# EAGLE board Main DIY board - no 3V3 (EAGLE 9.0.0)
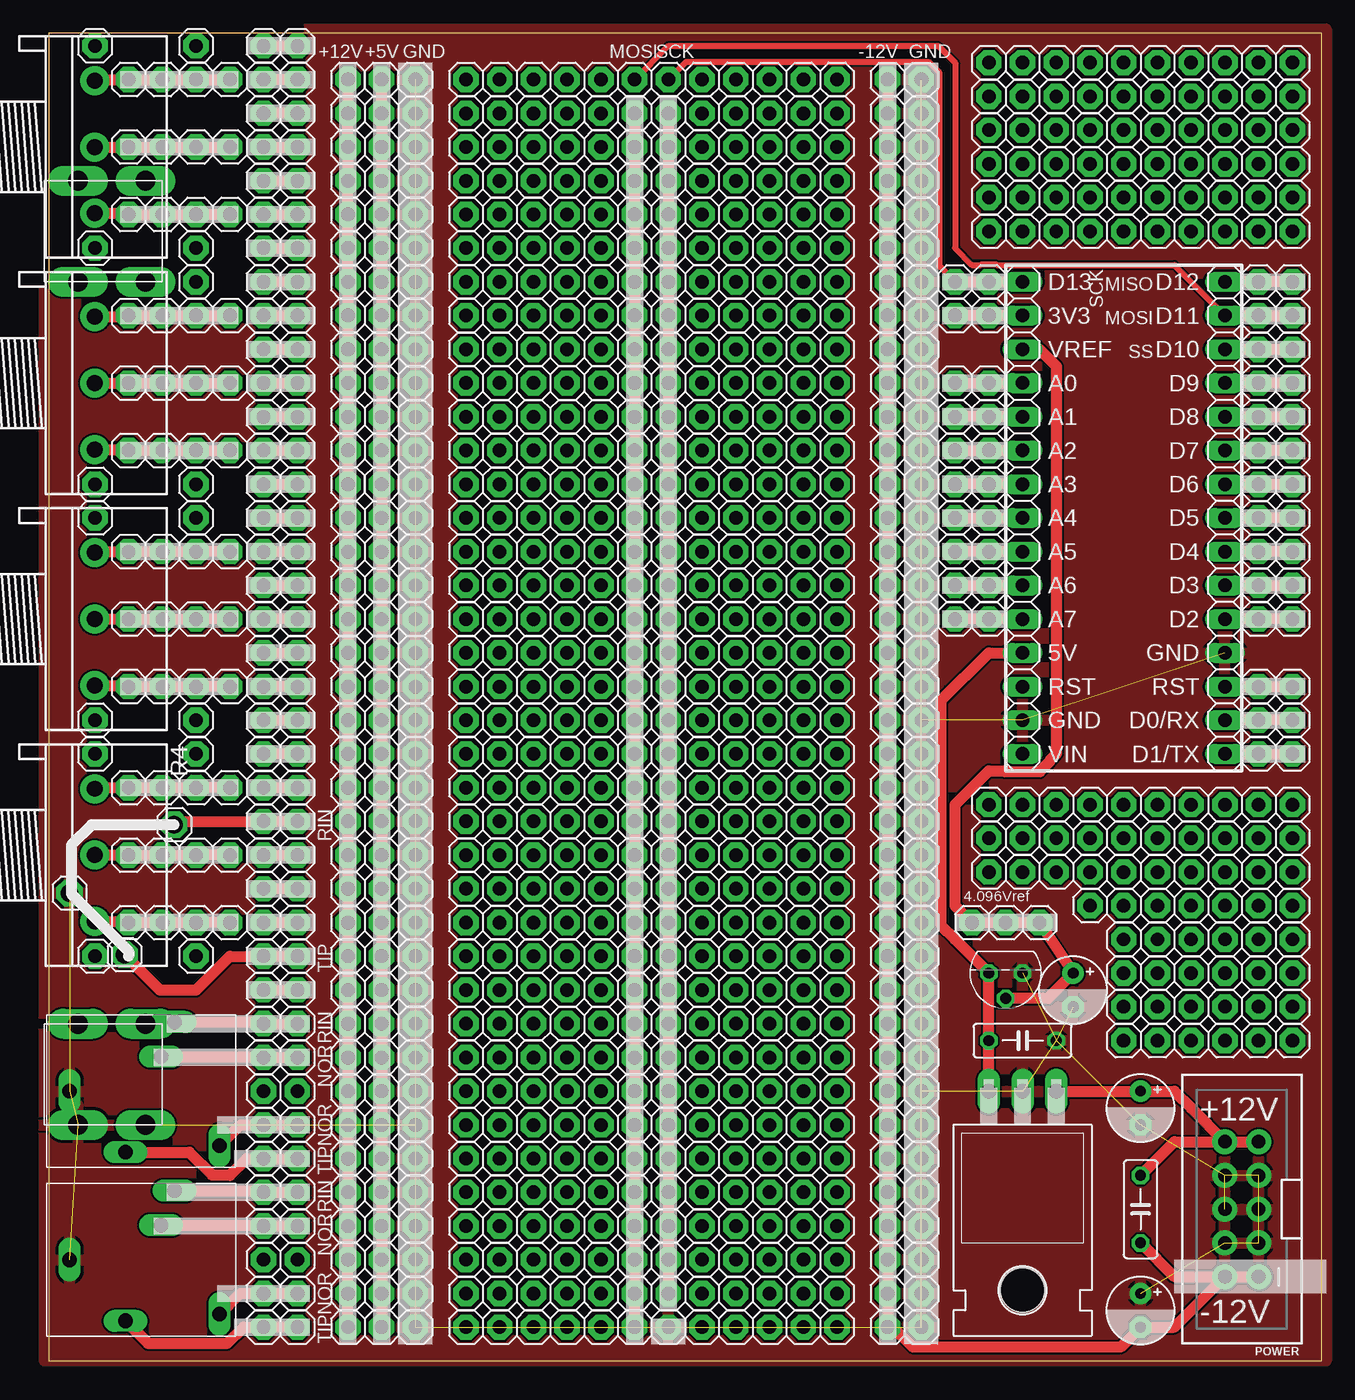
[diagram p2: board, top side]
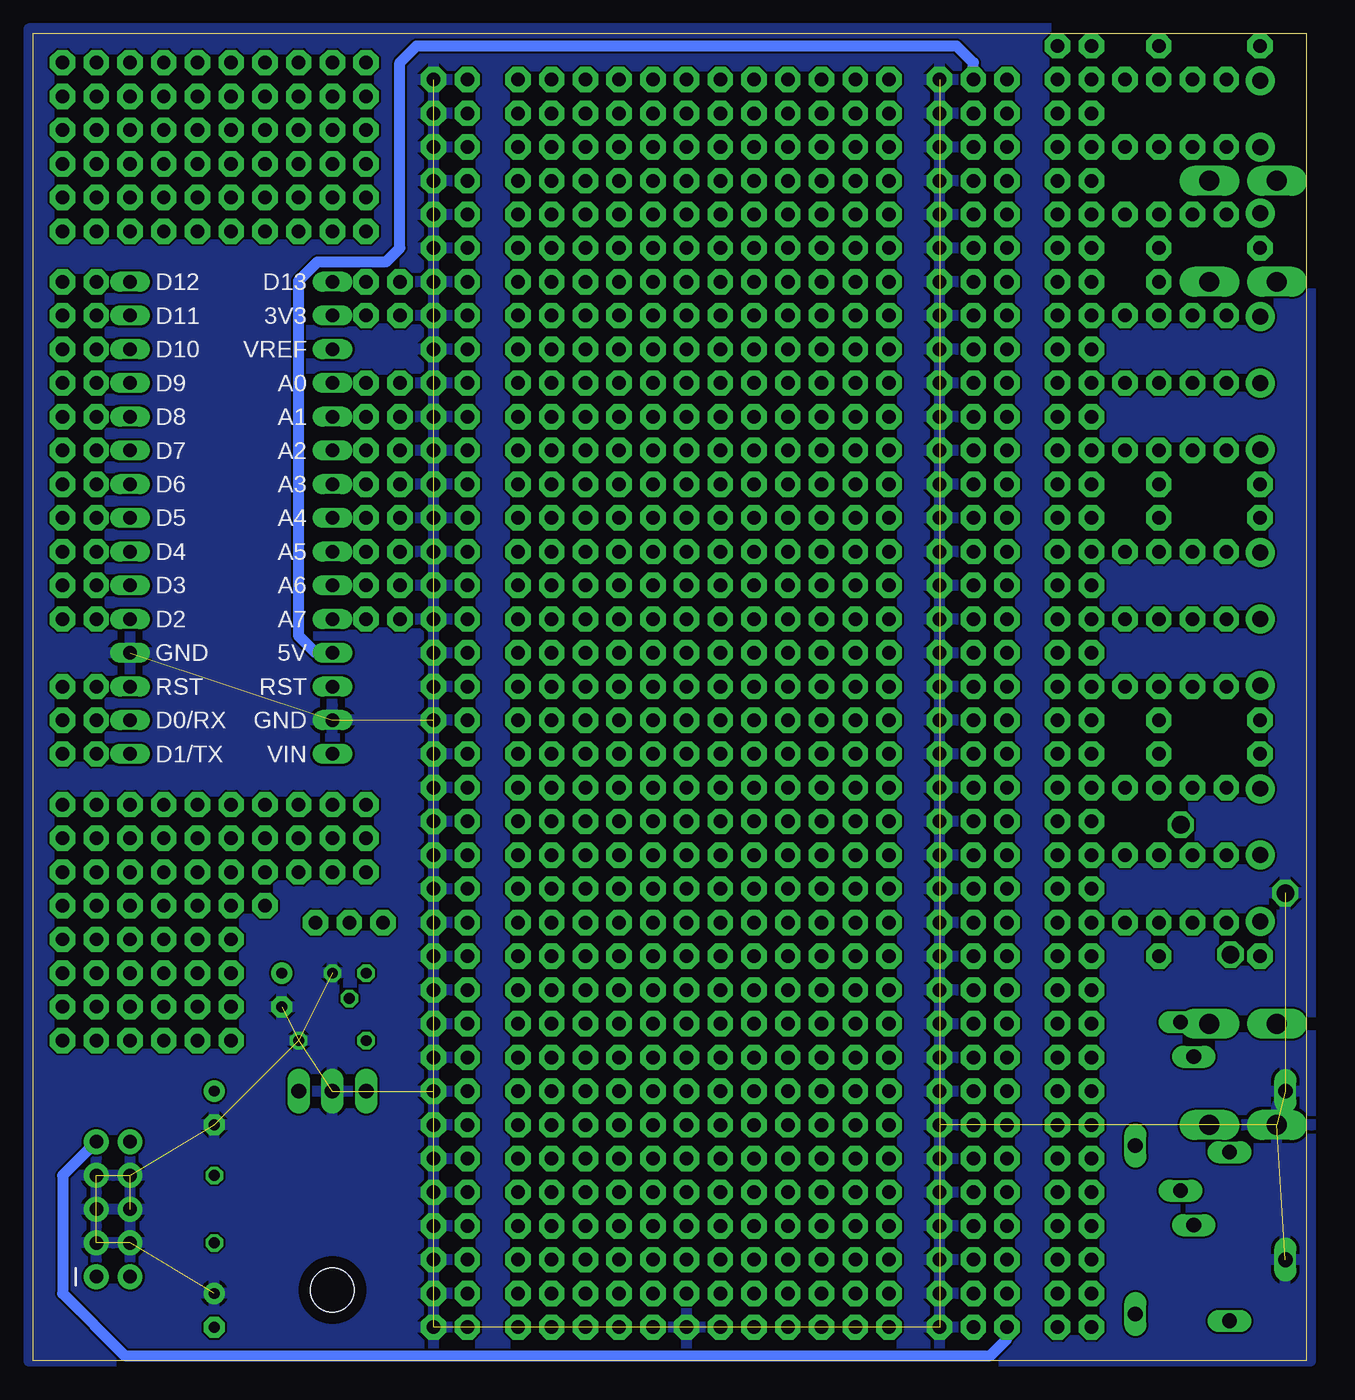
[diagram p3: board, bottom side, seen from below]

Size 95.87 x 100 mm. Coordinates in mm from the lower left corner, seen from the top.
Outline: 0,0 95.87,0 95.87,100 0,100 0,0
Copper layers (1*16): Top 0.035mm / dielectric 1.5mm / Bottom 0.035mm
Design rules "default *": minimum track width 6mil, minimum drill 0.35mm, track to track 6mil, track to pad 6mil, pad to pad 6mil, via to via 6mil, smd to smd 6mil, copper to edge 0mil, drill to drill 6mil, minimum pad ring 10mil, minimum via ring 8mil, stop-mask expansion 4mil, vias tented up to drill 0mil, thermal gap 10mil
Net classes: 0 default: width 0.457 mm, clearance 0.152 mm; 1 power: width 0.813 mm, clearance 0.152 mm

## Footprints (pad centres in the part's own frame; a part is rotated, then mirrored left to right if it is on the bottom)
1X15 = drill 1.016 long: 1 -17.78,0; 2 -15.24,0; 3 -12.7,0; 4 -10.16,0; 5 -7.62,0; 6 -5.08,0; 7 -2.54,0; 8 0,0; 9 2.54,0; 10 5.08,0; 11 7.62,0; 12 10.16,0; 13 12.7,0; 14 15.24,0; 15 17.78,0
C050-025X075 = drill 0.813 octagon: 1 -2.54,0; 2 2.54,0
E2,5-5 = drill 0.813 pad 1.6: + -1.27,0 | drill 0.813 pad 1.6 octagon: - 1.27,0
PJ-324MH = drill 1.1 long: 1 -5.4,0; 2 2.5,5.2; 3 1.5,2.6; 4 5.9,-4.1; 5 -1.2,-4.6
TO92 = drill 0.813 octagon: 1 -1.27,0; 2 0,1.905; 3 1.27,0
TO220H = drill 1.118 long: 1 -2.54,-10.16; 2 0,-10.16; 3 2.54,-10.16 | hole 3.302: 0,4.826
1X01 = drill 1.016 pad 1.905 octagon: 1 0,0
1X01-WIDE = drill 1.321 pad 1.778 octagon: 1 0,0
2X5-SHROUDED = drill 1.016 pad 1.88: 1 -1.27,5.08; 2 1.27,5.08; 3 -1.27,2.54; 4 1.27,2.54; 5 -1.27,0; 6 1.27,0; 7 -1.27,-2.54; 8 1.27,-2.54; 9 -1.27,-5.08; 10 1.27,-5.08
3RP/1610N = drill 1.2 pad 2.184: 1 -5,0; 2 0,0; 3 5,0
RIGHTANGLE = drill 1.5 long: P$1 -2.54,3.81; P$2 2.54,3.81; P$3 -2.54,-3.81; P$4 2.54,-3.81

## Placement (x,y rotation side)
ARD1  [1X15]  88.58,63.5 270 top
ARD2  [1X15]  73.34,63.5 270 top
C6  100n  [C050-025X075]  73.34,24.13 0 top
C7  100n  [C050-025X075]  82.23,11.43 270 top
C8  10u  [E2,5-5]  82.23,19.05 270 top
C9  10u  [E2,5-5]  82.23,3.81 270 top
C13  10u  [E2,5-5]  77.15,27.94 270 top
GATE1  [PJ-324MH]  6.98,20.32 0 top
GATE2  [PJ-324MH]  6.98,7.62 0 top
IC1  MC1541TO  [TO92]  72.07,29.21 180 top
IC3  7805  [TO220H]  73.34,10.16 180 top
JP1  1X01  [1X01]  3.49,83.82 0 top
JP2  1X01  [1X01]  6.03,86.36 0 top
JP3  1X01  [1X01]  8.57,86.36 0 top
JP4  1X01  [1X01]  3.49,99.06 0 top
JP5  1X01  [1X01]  11.11,86.36 0 top
JP6  1X01  [1X01]  6.03,91.44 0 top
JP7  1X01  [1X01]  8.57,91.44 0 top
JP8  1X01  [1X01]  11.11,91.44 0 top
JP9  1X01  [1X01]  6.03,96.52 0 top
JP10  1X01  [1X01]  8.57,96.52 0 top
JP11  1X01  [1X01]  11.11,96.52 0 top
JP12  1X01  [1X01]  11.11,99.06 0 top
JP13  1X01  [1X01]  11.11,83.82 0 top
JP14  1X01  [1X01]  6.03,68.58 0 top
JP15  1X01  [1X01]  11.11,68.58 0 top
JP16  1X01  [1X01]  8.57,68.58 0 top
JP17  1X01  [1X01]  6.03,73.66 0 top
JP18  1X01  [1X01]  11.11,73.66 0 top
JP19  1X01  [1X01]  8.57,73.66 0 top
JP20  1X01  [1X01]  6.03,78.74 0 top
JP21  1X01  [1X01]  11.11,78.74 0 top
JP22  1X01  [1X01]  8.57,78.74 0 top
JP23  1X01  [1X01]  6.03,50.8 0 top
JP24  1X01  [1X01]  11.11,50.8 0 top
JP25  1X01  [1X01]  8.57,50.8 0 top
JP26  1X01  [1X01]  6.03,55.88 0 top
JP27  1X01  [1X01]  11.11,55.88 0 top
JP28  1X01  [1X01]  8.57,55.88 0 top
JP29  1X01  [1X01]  6.03,60.96 0 top
JP30  1X01  [1X01]  11.11,60.96 0 top
JP31  1X01  [1X01]  8.57,60.96 0 top
JP32  1X01  [1X01]  3.49,45.72 0 top
JP33  1X01  [1X01]  11.11,45.72 0 top
JP34  1X01  [1X01]  8.57,33.02 0 top
JP35  1X01  [1X01]  6.03,33.02 0 top
JP36  1X01  [1X01]  11.11,33.02 0 top
JP37  1X01  [1X01]  6.03,38.1 0 top
JP38  1X01  [1X01]  8.57,38.1 0 top
JP39  1X01  [1X01]  11.11,38.1 0 top
JP40  1X01  [1X01]  6.03,43.18 0 top
JP41  1X01  [1X01]  8.57,43.18 0 top
JP42  1X01  [1X01]  11.11,43.18 0 top
JP43  1X01  [1X01]  3.49,30.48 0 top
JP44  1X01  [1X01]  11.11,30.48 0 top
JP45  1X01  [1X01]  13.65,86.36 0 top
JP46  1X01  [1X01]  16.19,99.06 0 top
JP47  1X01  [1X01]  13.65,91.44 0 top
JP48  1X01  [1X01]  18.73,99.06 0 top
JP49  1X01  [1X01]  13.65,96.52 0 top
JP50  1X01  [1X01]  16.19,71.12 0 top
JP51  1X01  [1X01]  13.65,68.58 0 top
JP52  1X01  [1X01]  18.73,71.12 0 top
JP53  1X01  [1X01]  13.65,73.66 0 top
JP54  1X01  [1X01]  16.19,60.96 0 top
JP55  1X01  [1X01]  13.65,78.74 0 top
JP56  1X01  [1X01]  18.73,60.96 0 top
JP57  1X01  [1X01]  13.65,50.8 0 top
JP58  1X01  [1X01]  16.19,96.52 0 top
JP59  1X01  [1X01]  13.65,55.88 0 top
JP60  1X01  [1X01]  18.73,96.52 0 top
JP61  1X01  [1X01]  13.65,60.96 0 top
JP62  1X01  [1X01]  16.19,91.44 0 top
JP63  1X01  [1X01]  13.65,33.02 0 top
JP64  1X01  [1X01]  18.73,91.44 0 top
JP65  1X01  [1X01]  13.65,38.1 0 top
JP66  1X01  [1X01]  16.19,73.66 0 top
JP67  1X01  [1X01]  13.65,43.18 0 top
JP68  1X01  [1X01]  18.73,73.66 0 top
JP69  1X01  [1X01]  16.19,68.58 0 top
JP70  1X01  [1X01]  18.73,68.58 0 top
JP71  1X01  [1X01]  16.19,93.98 0 top
JP72  1X01  [1X01]  18.73,93.98 0 top
JP73  1X01  [1X01]  16.19,88.9 0 top
JP74  1X01  [1X01]  18.73,88.9 0 top
JP75  1X01  [1X01]  16.19,76.2 0 top
JP76  1X01  [1X01]  18.73,76.2 0 top
JP77  1X01  [1X01]  18.73,66.04 0 top
JP78  1X01  [1X01]  16.19,66.04 0 top
JP79  1X01  [1X01]  16.19,86.36 0 top
JP80  1X01  [1X01]  18.73,86.36 0 top
JP81  1X01  [1X01]  18.73,83.82 0 top
JP82  1X01  [1X01]  16.19,83.82 0 top
JP83  1X01  [1X01]  16.19,78.74 0 top
JP84  1X01  [1X01]  18.73,78.74 0 top
JP85  1X01  [1X01]  18.73,63.5 0 top
JP86  1X01  [1X01]  16.19,63.5 0 top
JP87  1X01  [1X01]  16.19,30.48 0 top
JP88  1X01  [1X01]  16.19,55.88 0 top
JP89  1X01  [1X01]  18.73,55.88 0 top
JP90  1X01  [1X01]  16.19,53.34 0 top
JP91  1X01  [1X01]  16.19,81.28 0 top
JP92  1X01  [1X01]  18.73,81.28 0 top
JP93  1X01  [1X01]  18.73,53.34 0 top
JP94  1X01  [1X01]  18.73,58.42 0 top
JP95  1X01  [1X01]  16.19,58.42 0 top
JP96  1X01  [1X01]  16.19,48.26 0 top
JP97  1X01  [1X01]  18.73,48.26 0 top
JP98  1X01  [1X01]  16.19,50.8 0 top
JP99  1X01  [1X01]  18.73,50.8 0 top
JP100  1X01  [1X01]  18.73,43.18 0 top
JP101  1X01  [1X01]  16.19,43.18 0 top
JP102  1X01  [1X01]  18.73,40.64 0 top
JP103  1X01  [1X01]  16.19,40.64 0 top
JP104  1X01  [1X01]  16.19,45.72 0 top
JP105  1X01  [1X01]  18.73,45.72 0 top
JP106  1X01  [1X01]  18.73,38.1 0 top
JP107  1X01  [1X01]  16.19,38.1 0 top
JP108  1X01  [1X01]  18.73,35.56 0 top
JP109  1X01  [1X01]  16.19,35.56 0 top
JP110  1X01  [1X01]  16.19,27.94 0 top
JP111  1X01  [1X01]  18.73,27.94 0 top
JP112  1X01  [1X01]  18.73,33.02 0 top
JP113  1X01  [1X01]  16.19,33.02 0 top
JP114  1X01  [1X01]  22.54,96.52 0 top
JP115  1X01  [1X01]  22.54,93.98 0 top
JP116  1X01  [1X01]  18.73,30.48 0 top
JP117  1X01  [1X01]  22.54,91.44 0 top
JP118  1X01  [1X01]  22.54,88.9 0 top
JP119  1X01  [1X01]  22.54,86.36 0 top
JP120  1X01  [1X01]  22.54,83.82 0 top
JP121  1X01  [1X01]  22.54,81.28 0 top
JP122  1X01  [1X01]  22.54,78.74 0 top
JP123  1X01  [1X01]  22.54,76.2 0 top
JP124  1X01  [1X01]  22.54,73.66 0 top
JP125  1X01  [1X01]  22.54,71.12 0 top
JP126  1X01  [1X01]  22.54,68.58 0 top
JP127  1X01  [1X01]  22.54,66.04 0 top
JP128  1X01  [1X01]  22.54,63.5 0 top
JP129  1X01  [1X01]  22.54,60.96 0 top
JP130  1X01  [1X01]  22.54,58.42 0 top
JP131  1X01  [1X01]  22.54,55.88 0 top
JP132  1X01  [1X01]  22.54,53.34 0 top
JP133  1X01  [1X01]  22.54,50.8 0 top
JP134  1X01  [1X01]  22.54,48.26 0 top
JP135  1X01  [1X01]  22.54,45.72 0 top
JP136  1X01  [1X01]  22.54,43.18 0 top
JP137  1X01  [1X01]  22.54,40.64 0 top
JP138  1X01  [1X01]  22.54,38.1 0 top
JP139  1X01  [1X01]  22.54,35.56 0 top
JP140  1X01  [1X01]  22.54,33.02 0 top
JP141  1X01  [1X01]  22.54,30.48 0 top
JP142  1X01  [1X01]  22.54,27.94 0 top
JP143  1X01  [1X01]  22.54,25.4 0 top
JP144  1X01  [1X01]  22.54,22.86 0 top
JP145  1X01  [1X01]  22.54,20.32 0 top
JP146  1X01  [1X01]  22.54,17.78 0 top
JP147  1X01  [1X01]  22.54,15.24 0 top
JP148  1X01  [1X01]  22.54,12.7 0 top
JP149  1X01  [1X01]  22.54,10.16 0 top
JP150  1X01  [1X01]  22.54,7.62 0 top
JP151  1X01  [1X01]  22.54,5.08 0 top
JP152  1X01  [1X01]  22.54,2.54 0 top
JP153  1X01  [1X01]  3.49,63.5 0 top
JP154  1X01  [1X01]  27.62,93.98 0 top
JP155  1X01  [1X01]  27.62,91.44 0 top
JP156  1X01  [1X01]  27.62,88.9 0 top
JP157  1X01  [1X01]  27.62,86.36 0 top
JP158  1X01  [1X01]  27.62,83.82 0 top
JP159  1X01  [1X01]  27.62,81.28 0 top
JP160  1X01  [1X01]  27.62,78.74 0 top
JP161  1X01  [1X01]  27.62,76.2 0 top
JP162  1X01  [1X01]  27.62,73.66 0 top
JP163  1X01  [1X01]  27.62,71.12 0 top
JP164  1X01  [1X01]  27.62,68.58 0 top
JP165  1X01  [1X01]  27.62,66.04 0 top
JP166  1X01  [1X01]  27.62,60.96 0 top
JP167  1X01  [1X01]  27.62,55.88 0 top
JP168  1X01  [1X01]  27.62,50.8 0 top
JP169  1X01  [1X01]  27.62,45.72 0 top
JP170  1X01  [1X01]  27.62,40.64 0 top
JP171  1X01  [1X01]  27.62,35.56 0 top
JP172  1X01  [1X01]  27.62,30.48 0 top
JP173  1X01  [1X01]  27.62,25.4 0 top
JP174  1X01  [1X01]  27.62,20.32 0 top
JP175  1X01  [1X01]  27.62,15.24 0 top
JP176  1X01  [1X01]  27.62,10.16 0 top
JP177  1X01  [1X01]  27.62,63.5 0 top
JP178  1X01  [1X01]  27.62,58.42 0 top
JP179  1X01  [1X01]  27.62,53.34 0 top
JP180  1X01  [1X01]  27.62,48.26 0 top
JP181  1X01  [1X01]  27.62,43.18 0 top
JP182  1X01  [1X01]  27.62,38.1 0 top
JP183  1X01  [1X01]  27.62,33.02 0 top
JP184  1X01  [1X01]  27.62,27.94 0 top
JP185  1X01  [1X01]  27.62,22.86 0 top
JP186  1X01  [1X01]  27.62,17.78 0 top
JP187  1X01  [1X01]  27.62,12.7 0 top
JP188  1X01  [1X01]  27.62,7.62 0 top
JP189  1X01  [1X01]  27.62,5.08 0 top
JP190  1X01  [1X01]  27.62,2.54 0 top
JP191  1X01  [1X01]  31.43,96.52 0 top
JP192  1X01  [1X01]  11.11,63.5 0 top
JP193  1X01  [1X01]  44.13,93.98 0 top
JP194  1X01  [1X01]  44.13,91.44 0 top
JP195  1X01  [1X01]  44.13,88.9 0 top
JP196  1X01  [1X01]  44.13,86.36 0 top
JP197  1X01  [1X01]  44.13,83.82 0 top
JP198  1X01  [1X01]  44.13,81.28 0 top
JP199  1X01  [1X01]  44.13,78.74 0 top
JP200  1X01  [1X01]  44.13,76.2 0 top
JP201  1X01  [1X01]  44.13,73.66 0 top
JP202  1X01  [1X01]  44.13,71.12 0 top
JP203  1X01  [1X01]  44.13,68.58 0 top
JP204  1X01  [1X01]  44.13,66.04 0 top
JP205  1X01  [1X01]  44.13,63.5 0 top
JP206  1X01  [1X01]  44.13,60.96 0 top
JP207  1X01  [1X01]  44.13,58.42 0 top
JP208  1X01  [1X01]  44.13,55.88 0 top
JP209  1X01  [1X01]  44.13,53.34 0 top
JP210  1X01  [1X01]  44.13,50.8 0 top
JP211  1X01  [1X01]  44.13,45.72 0 top
JP212  1X01  [1X01]  44.13,48.26 0 top
JP213  1X01  [1X01]  44.13,43.18 0 top
JP214  1X01  [1X01]  44.13,40.64 0 top
JP215  1X01  [1X01]  44.13,38.1 0 top
JP216  1X01  [1X01]  44.13,35.56 0 top
JP217  1X01  [1X01]  44.13,33.02 0 top
JP218  1X01  [1X01]  44.13,30.48 0 top
JP219  1X01  [1X01]  44.13,27.94 0 top
JP220  1X01  [1X01]  44.13,20.32 0 top
JP221  1X01  [1X01]  44.13,25.4 0 top
JP222  1X01  [1X01]  44.13,22.86 0 top
JP223  1X01  [1X01]  44.13,17.78 0 top
JP224  1X01  [1X01]  44.13,15.24 0 top
JP225  1X01  [1X01]  44.13,12.7 0 top
JP226  1X01  [1X01]  44.13,7.62 0 top
JP227  1X01  [1X01]  44.13,5.08 0 top
JP228  1X01  [1X01]  44.13,10.16 0 top
JP229  1X01  [1X01]  36.51,96.52 0 top
JP230  1X01  [1X01]  46.67,86.36 0 top
JP231  1X01  [1X01]  3.49,48.26 0 top
JP232  1X01  [1X01]  46.67,93.98 0 top
JP233  1X01  [1X01]  46.67,91.44 0 top
JP234  1X01  [1X01]  46.67,88.9 0 top
JP235  1X01  [1X01]  46.67,73.66 0 top
JP236  1X01  [1X01]  46.67,71.12 0 top
JP237  1X01  [1X01]  46.67,68.58 0 top
JP238  1X01  [1X01]  46.67,66.04 0 top
JP239  1X01  [1X01]  46.67,83.82 0 top
JP240  1X01  [1X01]  46.67,81.28 0 top
JP241  1X01  [1X01]  46.67,78.74 0 top
JP242  1X01  [1X01]  46.67,76.2 0 top
JP243  1X01  [1X01]  46.67,53.34 0 top
JP244  1X01  [1X01]  46.67,50.8 0 top
JP245  1X01  [1X01]  46.67,48.26 0 top
JP246  1X01  [1X01]  46.67,45.72 0 top
JP247  1X01  [1X01]  46.67,63.5 0 top
JP248  1X01  [1X01]  46.67,60.96 0 top
JP249  1X01  [1X01]  46.67,58.42 0 top
JP250  1X01  [1X01]  46.67,55.88 0 top
JP251  1X01  [1X01]  46.67,33.02 0 top
JP252  1X01  [1X01]  46.67,30.48 0 top
JP253  1X01  [1X01]  46.67,27.94 0 top
JP254  1X01  [1X01]  46.67,25.4 0 top
JP255  1X01  [1X01]  46.67,43.18 0 top
JP256  1X01  [1X01]  46.67,40.64 0 top
JP257  1X01  [1X01]  46.67,38.1 0 top
JP258  1X01  [1X01]  46.67,35.56 0 top
JP259  1X01  [1X01]  46.67,15.24 0 top
JP260  1X01  [1X01]  46.67,12.7 0 top
JP261  1X01  [1X01]  46.67,10.16 0 top
JP262  1X01  [1X01]  46.67,7.62 0 top
JP263  1X01  [1X01]  46.67,22.86 0 top
JP264  1X01  [1X01]  46.67,20.32 0 top
JP265  1X01  [1X01]  46.67,17.78 0 top
JP266  1X01  [1X01]  31.43,91.44 0 top
JP267  1X01  [1X01]  63.18,96.52 0 top
JP268  1X01  [1X01]  63.18,93.98 0 top
JP269  1X01  [1X01]  63.18,91.44 0 top
JP270  1X01  [1X01]  63.18,86.36 0 top
JP271  1X01  [1X01]  63.18,83.82 0 top
JP272  1X01  [1X01]  63.18,81.28 0 top
JP273  1X01  [1X01]  63.18,78.74 0 top
JP274  1X01  [1X01]  63.18,76.2 0 top
JP275  1X01  [1X01]  63.18,73.66 0 top
JP276  1X01  [1X01]  63.18,71.12 0 top
JP277  1X01  [1X01]  63.18,88.9 0 top
JP278  1X01  [1X01]  63.18,68.58 0 top
JP279  1X01  [1X01]  63.18,66.04 0 top
JP280  1X01  [1X01]  63.18,63.5 0 top
JP281  1X01  [1X01]  63.18,60.96 0 top
JP282  1X01  [1X01]  63.18,58.42 0 top
JP283  1X01  [1X01]  63.18,55.88 0 top
JP284  1X01  [1X01]  63.18,53.34 0 top
JP285  1X01  [1X01]  63.18,50.8 0 top
JP286  1X01  [1X01]  63.18,48.26 0 top
JP287  1X01  [1X01]  63.18,45.72 0 top
JP288  1X01  [1X01]  63.18,43.18 0 top
JP289  1X01  [1X01]  63.18,40.64 0 top
JP290  1X01  [1X01]  63.18,38.1 0 top
JP291  1X01  [1X01]  63.18,35.56 0 top
JP292  1X01  [1X01]  63.18,33.02 0 top
JP293  1X01  [1X01]  63.18,30.48 0 top
JP294  1X01  [1X01]  63.18,27.94 0 top
JP295  1X01  [1X01]  63.18,25.4 0 top
JP296  1X01  [1X01]  63.18,22.86 0 top
JP297  1X01  [1X01]  63.18,20.32 0 top
JP298  1X01  [1X01]  63.18,17.78 0 top
JP299  1X01  [1X01]  63.18,15.24 0 top
JP300  1X01  [1X01]  63.18,12.7 0 top
JP301  1X01  [1X01]  63.18,10.16 0 top
JP302  1X01  [1X01]  63.18,7.62 0 top
JP303  1X01  [1X01]  63.18,2.54 0 top
JP304  1X01  [1X01]  63.18,5.08 0 top
JP305  1X01  [1X01]  65.72,86.36 0 top
JP306  1X01  [1X01]  65.72,83.82 0 top
JP307  1X01  [1X01]  65.72,96.52 0 top
JP308  1X01  [1X01]  65.72,93.98 0 top
JP309  1X01  [1X01]  65.72,91.44 0 top
JP310  1X01  [1X01]  65.72,88.9 0 top
JP311  1X01  [1X01]  65.72,71.12 0 top
JP312  1X01  [1X01]  65.72,68.58 0 top
JP313  1X01  [1X01]  65.72,66.04 0 top
JP314  1X01  [1X01]  65.72,63.5 0 top
JP315  1X01  [1X01]  65.72,81.28 0 top
JP316  1X01  [1X01]  65.72,78.74 0 top
JP317  1X01  [1X01]  65.72,76.2 0 top
JP318  1X01  [1X01]  65.72,73.66 0 top
JP319  1X01  [1X01]  65.72,30.48 0 top
JP320  1X01  [1X01]  65.72,27.94 0 top
JP321  1X01  [1X01]  65.72,25.4 0 top
JP322  1X01  [1X01]  65.72,22.86 0 top
JP323  1X01  [1X01]  65.72,60.96 0 top
JP324  1X01  [1X01]  65.72,58.42 0 top
JP325  1X01  [1X01]  65.72,50.8 0 top
JP326  1X01  [1X01]  65.72,45.72 0 top
JP327  1X01  [1X01]  65.72,55.88 0 top
JP328  1X01  [1X01]  65.72,53.34 0 top
JP329  1X01  [1X01]  65.72,48.26 0 top
JP330  1X01  [1X01]  65.72,43.18 0 top
JP331  1X01  [1X01]  65.72,40.64 0 top
JP332  1X01  [1X01]  65.72,38.1 0 top
JP333  1X01  [1X01]  65.72,35.56 0 top
JP334  1X01  [1X01]  65.72,33.02 0 top
JP335  1X01  [1X01]  65.72,20.32 0 top
JP336  1X01  [1X01]  65.72,17.78 0 top
JP337  1X01  [1X01]  65.72,15.24 0 top
JP338  1X01  [1X01]  65.72,12.7 0 top
JP339  1X01  [1X01]  65.72,10.16 0 top
JP340  1X01  [1X01]  65.72,7.62 0 top
JP341  1X01  [1X01]  65.72,5.08 0 top
JP342  1X01  [1X01]  65.72,2.54 0 top
JP343  1X01  [1X01]  46.67,2.54 0 top
JP344  1X01  [1X01]  44.13,96.52 0 top
JP345  1X01  [1X01]  46.67,96.52 0 top
JP346  1X01  [1X01]  33.97,88.9 0 top
JP347  1X01  [1X01]  33.97,96.52 0 top
JP348  1X01  [1X01]  33.97,93.98 0 top
JP349  1X01  [1X01]  36.51,93.98 0 top
JP350  1X01  [1X01]  33.97,91.44 0 top
JP351  1X01  [1X01]  39.05,91.44 0 top
JP352  1X01  [1X01]  36.51,88.9 0 top
JP353  1X01  [1X01]  31.43,93.98 0 top
JP354  1X01  [1X01]  39.05,93.98 0 top
JP355  1X01  [1X01]  41.59,93.98 0 top
JP356  1X01  [1X01]  36.51,91.44 0 top
JP357  1X01  [1X01]  41.59,91.44 0 top
JP358  1X01  [1X01]  31.43,88.9 0 top
JP359  1X01  [1X01]  41.59,88.9 0 top
JP360  1X01  [1X01]  39.05,88.9 0 top
JP361  1X01  [1X01]  31.43,86.36 0 top
JP362  1X01  [1X01]  33.97,86.36 0 top
JP363  1X01  [1X01]  41.59,96.52 0 top
JP364  1X01  [1X01]  36.51,86.36 0 top
JP365  1X01  [1X01]  41.59,86.36 0 top
JP366  1X01  [1X01]  39.05,86.36 0 top
JP367  1X01  [1X01]  36.51,78.74 0 top
JP368  1X01  [1X01]  39.05,78.74 0 top
JP369  1X01  [1X01]  41.59,78.74 0 top
JP370  1X01  [1X01]  33.97,76.2 0 top
JP371  1X01  [1X01]  41.59,71.12 0 top
JP372  1X01  [1X01]  39.05,71.12 0 top
JP373  1X01  [1X01]  41.59,68.58 0 top
JP374  1X01  [1X01]  33.97,68.58 0 top
JP375  1X01  [1X01]  41.59,63.5 0 top
JP376  1X01  [1X01]  31.43,60.96 0 top
JP377  1X01  [1X01]  33.97,60.96 0 top
JP378  1X01  [1X01]  41.59,60.96 0 top
JP379  1X01  [1X01]  31.43,83.82 0 top
JP380  1X01  [1X01]  36.51,83.82 0 top
JP381  1X01  [1X01]  39.05,83.82 0 top
JP382  1X01  [1X01]  39.05,96.52 0 top
JP383  1X01  [1X01]  31.43,76.2 0 top
JP384  1X01  [1X01]  36.51,76.2 0 top
JP385  1X01  [1X01]  39.05,76.2 0 top
JP386  1X01  [1X01]  41.59,81.28 0 top
JP387  1X01  [1X01]  31.43,78.74 0 top
JP388  1X01  [1X01]  33.97,78.74 0 top
JP389  1X01  [1X01]  36.51,68.58 0 top
JP390  1X01  [1X01]  39.05,68.58 0 top
JP391  1X01  [1X01]  33.97,66.04 0 top
JP392  1X01  [1X01]  31.43,71.12 0 top
JP393  1X01  [1X01]  33.97,71.12 0 top
JP394  1X01  [1X01]  36.51,71.12 0 top
JP395  1X01  [1X01]  39.05,60.96 0 top
JP396  1X01  [1X01]  33.97,58.42 0 top
JP397  1X01  [1X01]  31.43,58.42 0 top
JP398  1X01  [1X01]  41.59,66.04 0 top
JP399  1X01  [1X01]  36.51,63.5 0 top
JP400  1X01  [1X01]  39.05,63.5 0 top
JP401  1X01  [1X01]  33.97,83.82 0 top
JP402  1X01  [1X01]  41.59,83.82 0 top
JP403  1X01  [1X01]  31.43,81.28 0 top
JP404  1X01  [1X01]  33.97,81.28 0 top
JP405  1X01  [1X01]  36.51,81.28 0 top
JP406  1X01  [1X01]  39.05,81.28 0 top
JP407  1X01  [1X01]  41.59,76.2 0 top
JP408  1X01  [1X01]  31.43,73.66 0 top
JP409  1X01  [1X01]  33.97,73.66 0 top
JP410  1X01  [1X01]  39.05,73.66 0 top
JP411  1X01  [1X01]  36.51,73.66 0 top
JP412  1X01  [1X01]  41.59,73.66 0 top
JP413  1X01  [1X01]  31.43,68.58 0 top
JP414  1X01  [1X01]  31.43,66.04 0 top
JP415  1X01  [1X01]  36.51,66.04 0 top
JP416  1X01  [1X01]  39.05,66.04 0 top
JP417  1X01  [1X01]  31.43,63.5 0 top
JP418  1X01  [1X01]  33.97,63.5 0 top
JP419  1X01  [1X01]  36.51,60.96 0 top
JP420  1X01  [1X01]  39.05,58.42 0 top
JP421  1X01  [1X01]  36.51,58.42 0 top
JP422  1X01  [1X01]  41.59,58.42 0 top
JP423  1X01  [1X01]  36.51,55.88 0 top
JP424  1X01  [1X01]  39.05,55.88 0 top
JP425  1X01  [1X01]  41.59,55.88 0 top
JP426  1X01  [1X01]  39.05,50.8 0 top
JP427  1X01  [1X01]  33.97,48.26 0 top
JP428  1X01  [1X01]  39.05,48.26 0 top
JP429  1X01  [1X01]  36.51,50.8 0 top
JP430  1X01  [1X01]  31.43,48.26 0 top
JP431  1X01  [1X01]  36.51,48.26 0 top
JP432  1X01  [1X01]  41.59,43.18 0 top
JP433  1X01  [1X01]  39.05,40.64 0 top
JP434  1X01  [1X01]  31.43,38.1 0 top
JP435  1X01  [1X01]  39.05,35.56 0 top
JP436  1X01  [1X01]  33.97,33.02 0 top
JP437  1X01  [1X01]  39.05,33.02 0 top
JP438  1X01  [1X01]  36.51,35.56 0 top
JP439  1X01  [1X01]  31.43,33.02 0 top
JP440  1X01  [1X01]  36.51,33.02 0 top
JP441  1X01  [1X01]  41.59,27.94 0 top
JP442  1X01  [1X01]  31.43,25.4 0 top
JP443  1X01  [1X01]  33.97,25.4 0 top
JP444  1X01  [1X01]  33.97,20.32 0 top
JP445  1X01  [1X01]  41.59,20.32 0 top
JP446  1X01  [1X01]  36.51,17.78 0 top
JP447  1X01  [1X01]  31.43,20.32 0 top
JP448  1X01  [1X01]  39.05,20.32 0 top
JP449  1X01  [1X01]  33.97,17.78 0 top
JP450  1X01  [1X01]  36.51,12.7 0 top
JP451  1X01  [1X01]  39.05,12.7 0 top
JP452  1X01  [1X01]  41.59,12.7 0 top
JP453  1X01  [1X01]  31.43,5.08 0 top
JP454  1X01  [1X01]  36.51,5.08 0 top
JP455  1X01  [1X01]  41.59,5.08 0 top
JP456  1X01  [1X01]  39.05,7.62 0 top
JP457  1X01  [1X01]  41.59,7.62 0 top
JP458  1X01  [1X01]  39.05,5.08 0 top
JP459  1X01  [1X01]  41.59,50.8 0 top
JP460  1X01  [1X01]  41.59,48.26 0 top
JP461  1X01  [1X01]  33.97,45.72 0 top
JP462  1X01  [1X01]  31.43,45.72 0 top
JP463  1X01  [1X01]  41.59,45.72 0 top
JP464  1X01  [1X01]  36.51,43.18 0 top
JP465  1X01  [1X01]  33.97,55.88 0 top
JP466  1X01  [1X01]  33.97,53.34 0 top
JP467  1X01  [1X01]  39.05,53.34 0 top
JP468  1X01  [1X01]  41.59,35.56 0 top
JP469  1X01  [1X01]  41.59,33.02 0 top
JP470  1X01  [1X01]  31.43,30.48 0 top
JP471  1X01  [1X01]  33.97,30.48 0 top
JP472  1X01  [1X01]  41.59,30.48 0 top
JP473  1X01  [1X01]  36.51,27.94 0 top
JP474  1X01  [1X01]  31.43,40.64 0 top
JP475  1X01  [1X01]  36.51,38.1 0 top
JP476  1X01  [1X01]  39.05,38.1 0 top
JP477  1X01  [1X01]  36.51,20.32 0 top
JP478  1X01  [1X01]  31.43,17.78 0 top
JP479  1X01  [1X01]  39.05,17.78 0 top
JP480  1X01  [1X01]  41.59,17.78 0 top
JP481  1X01  [1X01]  36.51,15.24 0 top
JP482  1X01  [1X01]  31.43,12.7 0 top
JP483  1X01  [1X01]  36.51,25.4 0 top
JP484  1X01  [1X01]  41.59,25.4 0 top
JP485  1X01  [1X01]  33.97,22.86 0 top
JP486  1X01  [1X01]  33.97,5.08 0 top
JP487  1X01  [1X01]  31.43,2.54 0 top
JP488  1X01  [1X01]  33.97,2.54 0 top
JP489  1X01  [1X01]  36.51,2.54 0 top
JP490  1X01  [1X01]  39.05,2.54 0 top
JP491  1X01  [1X01]  41.59,2.54 0 top
JP492  1X01  [1X01]  31.43,10.16 0 top
JP493  1X01  [1X01]  36.51,10.16 0 top
JP494  1X01  [1X01]  41.59,10.16 0 top
JP495  1X01  [1X01]  31.43,55.88 0 top
JP496  1X01  [1X01]  31.43,53.34 0 top
JP497  1X01  [1X01]  36.51,53.34 0 top
JP498  1X01  [1X01]  41.59,53.34 0 top
JP499  1X01  [1X01]  31.43,50.8 0 top
JP500  1X01  [1X01]  33.97,50.8 0 top
JP501  1X01  [1X01]  36.51,40.64 0 top
JP502  1X01  [1X01]  41.59,40.64 0 top
JP503  1X01  [1X01]  33.97,40.64 0 top
JP504  1X01  [1X01]  33.97,38.1 0 top
JP505  1X01  [1X01]  41.59,38.1 0 top
JP506  1X01  [1X01]  31.43,35.56 0 top
JP507  1X01  [1X01]  33.97,35.56 0 top
JP508  1X01  [1X01]  39.05,25.4 0 top
JP509  1X01  [1X01]  31.43,22.86 0 top
JP510  1X01  [1X01]  36.51,22.86 0 top
JP511  1X01  [1X01]  39.05,22.86 0 top
JP512  1X01  [1X01]  41.59,22.86 0 top
JP513  1X01  [1X01]  33.97,10.16 0 top
JP514  1X01  [1X01]  39.05,10.16 0 top
JP515  1X01  [1X01]  31.43,7.62 0 top
JP516  1X01  [1X01]  33.97,7.62 0 top
JP517  1X01  [1X01]  36.51,7.62 0 top
JP518  1X01  [1X01]  36.51,45.72 0 top
JP519  1X01  [1X01]  31.43,43.18 0 top
JP520  1X01  [1X01]  39.05,43.18 0 top
JP521  1X01  [1X01]  39.05,45.72 0 top
JP522  1X01  [1X01]  33.97,43.18 0 top
JP523  1X01  [1X01]  36.51,30.48 0 top
JP524  1X01  [1X01]  31.43,27.94 0 top
JP525  1X01  [1X01]  39.05,27.94 0 top
JP526  1X01  [1X01]  39.05,30.48 0 top
JP527  1X01  [1X01]  33.97,27.94 0 top
JP528  1X01  [1X01]  31.43,15.24 0 top
JP529  1X01  [1X01]  39.05,15.24 0 top
JP530  1X01  [1X01]  33.97,12.7 0 top
JP531  1X01  [1X01]  33.97,15.24 0 top
JP532  1X01  [1X01]  41.59,15.24 0 top
JP533  1X01  [1X01]  49.21,96.52 0 top
JP534  1X01  [1X01]  59.37,96.52 0 top
JP535  1X01  [1X01]  56.83,93.98 0 top
JP536  1X01  [1X01]  54.29,91.44 0 top
JP537  1X01  [1X01]  51.75,88.9 0 top
JP538  1X01  [1X01]  56.83,88.9 0 top
JP539  1X01  [1X01]  49.21,86.36 0 top
JP540  1X01  [1X01]  54.29,86.36 0 top
JP541  1X01  [1X01]  59.37,86.36 0 top
JP542  1X01  [1X01]  51.75,83.82 0 top
JP543  1X01  [1X01]  51.75,96.52 0 top
JP544  1X01  [1X01]  49.21,93.98 0 top
JP545  1X01  [1X01]  59.37,93.98 0 top
JP546  1X01  [1X01]  56.83,91.44 0 top
JP547  1X01  [1X01]  56.83,81.28 0 top
JP548  1X01  [1X01]  54.29,78.74 0 top
JP549  1X01  [1X01]  51.75,76.2 0 top
JP550  1X01  [1X01]  49.21,73.66 0 top
JP551  1X01  [1X01]  59.37,73.66 0 top
JP552  1X01  [1X01]  51.75,71.12 0 top
JP553  1X01  [1X01]  56.83,71.12 0 top
JP554  1X01  [1X01]  49.21,68.58 0 top
JP555  1X01  [1X01]  54.29,68.58 0 top
JP556  1X01  [1X01]  59.37,68.58 0 top
JP557  1X01  [1X01]  59.37,81.28 0 top
JP558  1X01  [1X01]  56.83,78.74 0 top
JP559  1X01  [1X01]  54.29,76.2 0 top
JP560  1X01  [1X01]  51.75,73.66 0 top
JP561  1X01  [1X01]  51.75,60.96 0 top
JP562  1X01  [1X01]  49.21,58.42 0 top
JP563  1X01  [1X01]  54.29,58.42 0 top
JP564  1X01  [1X01]  56.83,55.88 0 top
JP565  1X01  [1X01]  54.29,53.34 0 top
JP566  1X01  [1X01]  59.37,53.34 0 top
JP567  1X01  [1X01]  51.75,50.8 0 top
JP568  1X01  [1X01]  56.83,50.8 0 top
JP569  1X01  [1X01]  49.21,48.26 0 top
JP570  1X01  [1X01]  54.29,48.26 0 top
JP571  1X01  [1X01]  54.29,60.96 0 top
JP572  1X01  [1X01]  51.75,58.42 0 top
JP573  1X01  [1X01]  56.83,58.42 0 top
JP574  1X01  [1X01]  59.37,55.88 0 top
JP575  1X01  [1X01]  51.75,43.18 0 top
JP576  1X01  [1X01]  49.21,40.64 0 top
JP577  1X01  [1X01]  59.37,40.64 0 top
JP578  1X01  [1X01]  56.83,38.1 0 top
JP579  1X01  [1X01]  54.29,35.56 0 top
JP580  1X01  [1X01]  56.83,35.56 0 top
JP581  1X01  [1X01]  49.21,33.02 0 top
JP582  1X01  [1X01]  54.29,33.02 0 top
JP583  1X01  [1X01]  59.37,33.02 0 top
JP584  1X01  [1X01]  51.75,30.48 0 top
JP585  1X01  [1X01]  54.29,43.18 0 top
JP586  1X01  [1X01]  51.75,40.64 0 top
JP587  1X01  [1X01]  49.21,38.1 0 top
JP588  1X01  [1X01]  59.37,38.1 0 top
JP589  1X01  [1X01]  59.37,30.48 0 top
JP590  1X01  [1X01]  56.83,27.94 0 top
JP591  1X01  [1X01]  54.29,25.4 0 top
JP592  1X01  [1X01]  51.75,22.86 0 top
JP593  1X01  [1X01]  49.21,20.32 0 top
JP594  1X01  [1X01]  54.29,20.32 0 top
JP595  1X01  [1X01]  59.37,20.32 0 top
JP596  1X01  [1X01]  51.75,17.78 0 top
JP597  1X01  [1X01]  56.83,17.78 0 top
JP598  1X01  [1X01]  49.21,15.24 0 top
JP599  1X01  [1X01]  49.21,27.94 0 top
JP600  1X01  [1X01]  59.37,27.94 0 top
JP601  1X01  [1X01]  56.83,25.4 0 top
JP602  1X01  [1X01]  54.29,22.86 0 top
JP603  1X01  [1X01]  54.29,15.24 0 top
JP604  1X01  [1X01]  54.29,12.7 0 top
JP605  1X01  [1X01]  51.75,10.16 0 top
JP606  1X01  [1X01]  49.21,7.62 0 top
JP607  1X01  [1X01]  59.37,7.62 0 top
JP608  1X01  [1X01]  51.75,12.7 0 top
JP609  1X01  [1X01]  54.29,5.08 0 top
JP610  1X01  [1X01]  59.37,5.08 0 top
JP611  1X01  [1X01]  51.75,2.54 0 top
JP612  1X01  [1X01]  56.83,2.54 0 top
JP613  1X01  [1X01]  56.83,15.24 0 top
JP614  1X01  [1X01]  56.83,12.7 0 top
JP615  1X01  [1X01]  54.29,10.16 0 top
JP616  1X01  [1X01]  51.75,7.62 0 top
JP617  1X01  [1X01]  59.37,88.9 0 top
JP618  1X01  [1X01]  51.75,86.36 0 top
JP619  1X01  [1X01]  56.83,86.36 0 top
JP620  1X01  [1X01]  49.21,83.82 0 top
JP621  1X01  [1X01]  54.29,83.82 0 top
JP622  1X01  [1X01]  54.29,96.52 0 top
JP623  1X01  [1X01]  51.75,93.98 0 top
JP624  1X01  [1X01]  49.21,91.44 0 top
JP625  1X01  [1X01]  59.37,91.44 0 top
JP626  1X01  [1X01]  54.29,88.9 0 top
JP627  1X01  [1X01]  56.83,96.52 0 top
JP628  1X01  [1X01]  54.29,93.98 0 top
JP629  1X01  [1X01]  51.75,91.44 0 top
JP630  1X01  [1X01]  49.21,88.9 0 top
JP631  1X01  [1X01]  54.29,71.12 0 top
JP632  1X01  [1X01]  59.37,71.12 0 top
JP633  1X01  [1X01]  51.75,68.58 0 top
JP634  1X01  [1X01]  56.83,68.58 0 top
JP635  1X01  [1X01]  49.21,66.04 0 top
JP636  1X01  [1X01]  49.21,78.74 0 top
JP637  1X01  [1X01]  59.37,78.74 0 top
JP638  1X01  [1X01]  56.83,76.2 0 top
JP639  1X01  [1X01]  54.29,73.66 0 top
JP640  1X01  [1X01]  49.21,71.12 0 top
JP641  1X01  [1X01]  51.75,78.74 0 top
JP642  1X01  [1X01]  49.21,76.2 0 top
JP643  1X01  [1X01]  59.37,76.2 0 top
JP644  1X01  [1X01]  56.83,73.66 0 top
JP645  1X01  [1X01]  49.21,50.8 0 top
JP646  1X01  [1X01]  54.29,50.8 0 top
JP647  1X01  [1X01]  59.37,50.8 0 top
JP648  1X01  [1X01]  51.75,48.26 0 top
JP649  1X01  [1X01]  49.21,45.72 0 top
JP650  1X01  [1X01]  56.83,60.96 0 top
JP651  1X01  [1X01]  49.21,55.88 0 top
JP652  1X01  [1X01]  59.37,58.42 0 top
JP653  1X01  [1X01]  51.75,53.34 0 top
JP654  1X01  [1X01]  56.83,53.34 0 top
JP655  1X01  [1X01]  59.37,60.96 0 top
JP656  1X01  [1X01]  51.75,55.88 0 top
JP657  1X01  [1X01]  54.29,55.88 0 top
JP658  1X01  [1X01]  49.21,53.34 0 top
JP659  1X01  [1X01]  59.37,35.56 0 top
JP660  1X01  [1X01]  51.75,33.02 0 top
JP661  1X01  [1X01]  56.83,33.02 0 top
JP662  1X01  [1X01]  49.21,30.48 0 top
JP663  1X01  [1X01]  54.29,30.48 0 top
JP664  1X01  [1X01]  56.83,43.18 0 top
JP665  1X01  [1X01]  54.29,40.64 0 top
JP666  1X01  [1X01]  51.75,38.1 0 top
JP667  1X01  [1X01]  49.21,35.56 0 top
JP668  1X01  [1X01]  56.83,30.48 0 top
JP669  1X01  [1X01]  59.37,43.18 0 top
JP670  1X01  [1X01]  56.83,40.64 0 top
JP671  1X01  [1X01]  54.29,38.1 0 top
JP672  1X01  [1X01]  51.75,35.56 0 top
JP673  1X01  [1X01]  56.83,20.32 0 top
JP674  1X01  [1X01]  49.21,17.78 0 top
JP675  1X01  [1X01]  54.29,17.78 0 top
JP676  1X01  [1X01]  59.37,17.78 0 top
JP677  1X01  [1X01]  51.75,15.24 0 top
JP678  1X01  [1X01]  51.75,27.94 0 top
JP679  1X01  [1X01]  49.21,25.4 0 top
JP680  1X01  [1X01]  59.37,25.4 0 top
JP681  1X01  [1X01]  56.83,22.86 0 top
JP682  1X01  [1X01]  51.75,20.32 0 top
JP683  1X01  [1X01]  54.29,27.94 0 top
JP684  1X01  [1X01]  51.75,25.4 0 top
JP685  1X01  [1X01]  49.21,22.86 0 top
JP686  1X01  [1X01]  59.37,22.86 0 top
JP687  1X01  [1X01]  51.75,5.08 0 top
JP688  1X01  [1X01]  56.83,5.08 0 top
JP689  1X01  [1X01]  49.21,2.54 0 top
JP690  1X01  [1X01]  54.29,2.54 0 top
JP691  1X01  [1X01]  59.37,2.54 0 top
JP692  1X01  [1X01]  59.37,15.24 0 top
JP693  1X01  [1X01]  59.37,12.7 0 top
JP694  1X01  [1X01]  56.83,10.16 0 top
JP695  1X01  [1X01]  54.29,7.62 0 top
JP696  1X01  [1X01]  49.21,5.08 0 top
JP697  1X01  [1X01]  49.21,12.7 0 top
JP698  1X01  [1X01]  49.21,10.16 0 top
JP699  1X01  [1X01]  59.37,10.16 0 top
JP700  1X01  [1X01]  56.83,7.62 0 top
JP701  1X01  [1X01]  56.83,83.82 0 top
JP702  1X01  [1X01]  59.37,83.82 0 top
JP703  1X01  [1X01]  49.21,81.28 0 top
JP704  1X01  [1X01]  51.75,81.28 0 top
JP705  1X01  [1X01]  54.29,81.28 0 top
JP706  1X01  [1X01]  51.75,63.5 0 top
JP707  1X01  [1X01]  54.29,63.5 0 top
JP708  1X01  [1X01]  56.83,63.5 0 top
JP709  1X01  [1X01]  59.37,63.5 0 top
JP710  1X01  [1X01]  49.21,60.96 0 top
JP711  1X01  [1X01]  56.83,48.26 0 top
JP712  1X01  [1X01]  59.37,48.26 0 top
JP713  1X01  [1X01]  51.75,45.72 0 top
JP714  1X01  [1X01]  54.29,45.72 0 top
JP715  1X01  [1X01]  51.75,66.04 0 top
JP716  1X01  [1X01]  54.29,66.04 0 top
JP717  1X01  [1X01]  56.83,66.04 0 top
JP718  1X01  [1X01]  59.37,66.04 0 top
JP719  1X01  [1X01]  49.21,63.5 0 top
JP720  1X01  [1X01]  56.83,45.72 0 top
JP721  1X01  [1X01]  59.37,45.72 0 top
JP722  1X01  [1X01]  49.21,43.18 0 top
JP723  1X01  [1X01]  46.67,5.08 0 top
JP724  1X01  [1X01]  44.13,2.54 0 top
JP725  1X01  [1X01]  16.19,25.4 0 top
JP726  1X01  [1X01]  16.19,22.86 0 top
JP727  1X01  [1X01]  16.19,17.78 0 top
JP728  1X01  [1X01]  16.19,15.24 0 top
JP729  1X01  [1X01]  16.19,12.7 0 top
JP730  1X01  [1X01]  16.19,10.16 0 top
JP731  1X01  [1X01]  16.19,5.08 0 top
JP732  1X01  [1X01]  16.19,2.54 0 top
JP733  1X01  [1X01]  18.73,25.4 0 top
JP734  1X01  [1X01]  18.73,22.86 0 top
JP735  1X01  [1X01]  18.73,15.24 0 top
JP736  1X01  [1X01]  18.73,17.78 0 top
JP737  1X01  [1X01]  18.73,12.7 0 top
JP738  1X01  [1X01]  18.73,10.16 0 top
JP739  1X01  [1X01]  18.73,5.08 0 top
JP740  1X01  [1X01]  18.73,2.54 0 top
JP741  1X01  [1X01]  11.11,48.26 0 top
JP742  1X01  [1X01]  25.08,93.98 0 top
JP743  1X01  [1X01]  25.08,91.44 0 top
JP744  1X01  [1X01]  25.08,88.9 0 top
JP745  1X01  [1X01]  25.08,83.82 0 top
JP746  1X01  [1X01]  25.08,86.36 0 top
JP747  1X01  [1X01]  25.08,76.2 0 top
JP748  1X01  [1X01]  25.08,73.66 0 top
JP749  1X01  [1X01]  25.08,71.12 0 top
JP750  1X01  [1X01]  25.08,68.58 0 top
JP751  1X01  [1X01]  25.08,78.74 0 top
JP752  1X01  [1X01]  25.08,81.28 0 top
JP753  1X01  [1X01]  25.08,60.96 0 top
JP754  1X01  [1X01]  25.08,58.42 0 top
JP755  1X01  [1X01]  25.08,55.88 0 top
JP756  1X01  [1X01]  25.08,53.34 0 top
JP757  1X01  [1X01]  25.08,50.8 0 top
JP758  1X01  [1X01]  25.08,63.5 0 top
JP759  1X01  [1X01]  25.08,45.72 0 top
JP760  1X01  [1X01]  25.08,43.18 0 top
JP761  1X01  [1X01]  25.08,40.64 0 top
JP762  1X01  [1X01]  25.08,38.1 0 top
JP763  1X01  [1X01]  25.08,35.56 0 top
JP764  1X01  [1X01]  25.08,48.26 0 top
JP765  1X01  [1X01]  25.08,33.02 0 top
JP766  1X01  [1X01]  25.08,30.48 0 top
JP767  1X01  [1X01]  25.08,27.94 0 top
JP768  1X01  [1X01]  25.08,25.4 0 top
JP769  1X01  [1X01]  25.08,20.32 0 top
JP770  1X01  [1X01]  25.08,22.86 0 top
JP771  1X01  [1X01]  25.08,15.24 0 top
JP772  1X01  [1X01]  25.08,12.7 0 top
JP773  1X01  [1X01]  25.08,10.16 0 top
JP774  1X01  [1X01]  25.08,7.62 0 top
JP775  1X01  [1X01]  25.08,2.54 0 top
JP776  1X01  [1X01]  25.08,5.08 0 top
JP777  1X01  [1X01]  25.08,17.78 90 top
JP778  1X01  [1X01]  25.08,96.52 90 top
JP779  1X01  [1X01]  27.62,96.52 90 top
JP780  1X01  [1X01]  25.08,66.04 90 top
JP781  1X01  [1X01]  74.61,33.02 0 top
JP782  1X01  [1X01]  72.07,33.02 0 top
JP783  1X01  [1X01]  69.53,33.02 0 top
JP784  1X01  [1X01]  80.96,41.91 0 top
JP785  1X01  [1X01]  11.11,81.28 0 top
JP786  1X01  [1X01]  3.49,66.04 0 top
JP787  1X01  [1X01]  11.11,66.04 0 top
JP788  1X01-WIDE  [1X01-WIDE]  1.59,35.24 0 top
JP789  1X01-WIDE  [1X01-WIDE]  5.71,30.61 0 top
JP790  1X01-WIDE  [1X01-WIDE]  9.46,40.39 0 top
JP791  1X01  [1X01]  16.19,20.32 0 top
JP792  1X01  [1X01]  18.73,20.32 0 top
JP793  1X01  [1X01]  16.19,7.62 0 top
JP794  1X01  [1X01]  18.73,7.62 0 top
JP795  1X01  [1X01]  70.8,81.28 0 top
JP796  1X01  [1X01]  68.26,81.28 0 top
JP797  1X01  [1X01]  70.8,78.74 0 top
JP798  1X01  [1X01]  68.26,78.74 0 top
JP799  1X01  [1X01]  93.66,55.88 0 top
JP800  1X01  [1X01]  91.12,55.88 0 top
JP801  1X01  [1X01]  70.8,73.66 0 top
JP802  1X01  [1X01]  68.26,73.66 0 top
JP803  1X01  [1X01]  70.8,71.12 0 top
JP804  1X01  [1X01]  68.26,71.12 0 top
JP805  1X01  [1X01]  70.8,68.58 0 top
JP806  1X01  [1X01]  68.26,68.58 0 top
JP807  1X01  [1X01]  70.8,66.04 0 top
JP808  1X01  [1X01]  68.26,66.04 0 top
JP809  1X01  [1X01]  70.8,63.5 0 top
JP810  1X01  [1X01]  68.26,63.5 0 top
JP811  1X01  [1X01]  70.8,60.96 0 top
JP812  1X01  [1X01]  68.26,60.96 0 top
JP813  1X01  [1X01]  70.8,58.42 0 top
JP814  1X01  [1X01]  68.26,58.42 0 top
JP815  1X01  [1X01]  70.8,55.88 0 top
JP816  1X01  [1X01]  68.26,55.88 0 top
JP817  1X01  [1X01]  93.66,58.42 0 top
JP818  1X01  [1X01]  91.12,58.42 0 top
JP819  1X01  [1X01]  93.66,63.5 0 top
JP820  1X01  [1X01]  91.12,63.5 0 top
JP821  1X01  [1X01]  93.66,66.04 0 top
JP822  1X01  [1X01]  91.12,66.04 0 top
JP823  1X01  [1X01]  93.66,68.58 0 top
JP824  1X01  [1X01]  91.12,68.58 0 top
JP825  1X01  [1X01]  93.66,71.12 0 top
JP826  1X01  [1X01]  91.12,71.12 0 top
JP827  1X01  [1X01]  93.66,73.66 0 top
JP828  1X01  [1X01]  91.12,73.66 0 top
JP829  1X01  [1X01]  93.66,76.2 0 top
JP830  1X01  [1X01]  91.12,76.2 0 top
JP831  1X01  [1X01]  93.66,78.74 0 top
JP832  1X01  [1X01]  91.12,78.74 0 top
JP833  1X01  [1X01]  93.66,81.28 0 top
JP834  1X01  [1X01]  91.12,81.28 0 top
JP835  1X01  [1X01]  91.12,60.96 0 top
JP836  1X01  [1X01]  93.66,60.96 0 top
JP837  1X01  [1X01]  91.12,48.26 0 top
JP838  1X01  [1X01]  93.66,48.26 0 top
JP839  1X01  [1X01]  91.12,45.72 0 top
JP840  1X01  [1X01]  93.66,45.72 0 top
JP841  1X01  [1X01]  91.12,50.8 0 top
JP842  1X01  [1X01]  93.66,50.8 0 top
JP843  1X01  [1X01]  70.8,97.79 0 top
JP844  1X01  [1X01]  73.34,97.79 0 top
JP845  1X01  [1X01]  75.88,97.79 0 top
JP846  1X01  [1X01]  78.42,97.79 0 top
JP847  1X01  [1X01]  80.96,97.79 0 top
JP848  1X01  [1X01]  83.5,97.79 0 top
JP849  1X01  [1X01]  86.04,97.79 0 top
JP850  1X01  [1X01]  88.58,97.79 0 top
JP851  1X01  [1X01]  91.12,97.79 0 top
JP852  1X01  [1X01]  93.66,97.79 0 top
JP853  1X01  [1X01]  70.8,95.25 0 top
JP854  1X01  [1X01]  73.34,95.25 0 top
JP855  1X01  [1X01]  75.88,95.25 0 top
JP856  1X01  [1X01]  78.42,95.25 0 top
JP857  1X01  [1X01]  80.96,95.25 0 top
JP858  1X01  [1X01]  83.5,95.25 0 top
JP859  1X01  [1X01]  86.04,95.25 0 top
JP860  1X01  [1X01]  88.58,95.25 0 top
JP861  1X01  [1X01]  91.12,95.25 0 top
JP862  1X01  [1X01]  93.66,95.25 0 top
JP863  1X01  [1X01]  70.8,92.71 0 top
JP864  1X01  [1X01]  73.34,92.71 0 top
JP865  1X01  [1X01]  75.88,92.71 0 top
JP866  1X01  [1X01]  88.58,92.71 0 top
JP867  1X01  [1X01]  78.42,92.71 0 top
JP868  1X01  [1X01]  80.96,90.17 0 top
JP869  1X01  [1X01]  70.8,90.17 0 top
JP870  1X01  [1X01]  91.12,90.17 0 top
JP871  1X01  [1X01]  88.58,90.17 0 top
JP872  1X01  [1X01]  93.66,92.71 0 top
JP873  1X01  [1X01]  91.12,92.71 0 top
JP874  1X01  [1X01]  93.66,90.17 0 top
JP875  1X01  [1X01]  73.34,90.17 0 top
JP876  1X01  [1X01]  86.04,92.71 0 top
JP877  1X01  [1X01]  78.42,90.17 0 top
JP878  1X01  [1X01]  75.88,90.17 0 top
JP879  1X01  [1X01]  83.5,90.17 0 top
JP880  1X01  [1X01]  86.04,90.17 0 top
JP881  1X01  [1X01]  80.96,92.71 0 top
JP882  1X01  [1X01]  83.5,92.71 0 top
JP883  1X01  [1X01]  70.8,87.63 0 top
JP884  1X01  [1X01]  78.42,87.63 0 top
JP885  1X01  [1X01]  73.34,87.63 0 top
JP886  1X01  [1X01]  75.88,87.63 0 top
JP887  1X01  [1X01]  80.96,87.63 0 top
JP888  1X01  [1X01]  86.04,87.63 0 top
JP889  1X01  [1X01]  73.34,85.09 0 top
JP890  1X01  [1X01]  78.42,85.09 0 top
JP891  1X01  [1X01]  86.04,85.09 0 top
JP892  1X01  [1X01]  83.5,85.09 0 top
JP893  1X01  [1X01]  83.5,87.63 0 top
JP894  1X01  [1X01]  88.58,87.63 0 top
JP895  1X01  [1X01]  93.66,85.09 0 top
JP896  1X01  [1X01]  75.88,85.09 0 top
JP897  1X01  [1X01]  91.12,87.63 0 top
JP898  1X01  [1X01]  70.8,85.09 0 top
JP899  1X01  [1X01]  91.12,85.09 0 top
JP900  1X01  [1X01]  93.66,87.63 0 top
JP901  1X01  [1X01]  88.58,85.09 0 top
JP902  1X01  [1X01]  80.96,85.09 0 top
JP903  1X01  [1X01]  86.04,41.91 0 top
JP904  1X01  [1X01]  88.58,41.91 0 top
JP905  1X01  [1X01]  91.12,41.91 0 top
JP906  1X01  [1X01]  93.66,41.91 0 top
JP907  1X01  [1X01]  80.96,39.37 0 top
JP908  1X01  [1X01]  83.5,41.91 0 top
JP909  1X01  [1X01]  83.5,39.37 0 top
JP910  1X01  [1X01]  86.04,39.37 0 top
JP911  1X01  [1X01]  88.58,39.37 0 top
JP912  1X01  [1X01]  91.12,39.37 0 top
JP913  1X01  [1X01]  93.66,39.37 0 top
JP914  1X01  [1X01]  80.96,36.83 0 top
JP915  1X01  [1X01]  83.5,36.83 0 top
JP916  1X01  [1X01]  86.04,36.83 0 top
JP917  1X01  [1X01]  88.58,36.83 0 top
JP918  1X01  [1X01]  91.12,36.83 0 top
JP919  1X01  [1X01]  93.66,36.83 0 top
JP920  1X01  [1X01]  80.96,34.29 0 top
JP921  1X01  [1X01]  83.5,34.29 0 top
JP922  1X01  [1X01]  86.04,34.29 0 top
JP923  1X01  [1X01]  88.58,34.29 0 top
JP924  1X01  [1X01]  91.12,34.29 0 top
JP925  1X01  [1X01]  93.66,34.29 0 top
JP926  1X01  [1X01]  80.96,31.75 0 top
JP927  1X01  [1X01]  83.5,31.75 0 top
JP928  1X01  [1X01]  86.04,31.75 0 top
JP929  1X01  [1X01]  88.58,31.75 0 top
JP930  1X01  [1X01]  91.12,31.75 0 top
JP931  1X01  [1X01]  93.66,31.75 0 top
JP932  1X01  [1X01]  80.96,29.21 0 top
JP933  1X01  [1X01]  83.5,29.21 0 top
JP934  1X01  [1X01]  86.04,29.21 0 top
JP935  1X01  [1X01]  88.58,29.21 0 top
JP936  1X01  [1X01]  91.12,29.21 0 top
JP937  1X01  [1X01]  93.66,29.21 0 top
JP938  1X01  [1X01]  80.96,26.67 0 top
JP939  1X01  [1X01]  83.5,26.67 0 top
JP940  1X01  [1X01]  86.04,26.67 0 top
JP941  1X01  [1X01]  88.58,26.67 0 top
JP942  1X01  [1X01]  91.12,26.67 0 top
JP943  1X01  [1X01]  93.66,26.67 0 top
JP944  1X01  [1X01]  80.96,24.13 0 top
JP945  1X01  [1X01]  83.5,24.13 0 top
JP946  1X01  [1X01]  86.04,24.13 0 top
JP947  1X01  [1X01]  88.58,24.13 0 top
JP948  1X01  [1X01]  91.12,24.13 0 top
JP949  1X01  [1X01]  93.66,24.13 0 top
JP950  1X01  [1X01]  78.42,41.91 0 top
JP951  1X01  [1X01]  78.42,39.37 0 top
JP952  1X01  [1X01]  78.42,36.83 0 top
JP953  1X01  [1X01]  78.42,34.29 0 top
JP954  1X01  [1X01]  75.88,39.37 0 top
JP955  1X01  [1X01]  75.88,41.91 0 top
JP956  1X01  [1X01]  75.88,36.83 0 top
JP957  1X01  [1X01]  73.34,41.91 0 top
JP958  1X01  [1X01]  73.34,39.37 0 top
JP959  1X01  [1X01]  70.8,41.91 0 top
JP960  1X01  [1X01]  70.8,39.37 0 top
JP961  1X01  [1X01]  73.34,36.83 0 top
JP962  1X01  [1X01]  70.8,36.83 0 top
POWER  [2X5-SHROUDED]  89.85,11.43 180 top
R1  [3RP/1610N]  3.49,91.44 270 top
R2  [3RP/1610N]  3.49,73.66 270 top
R3  [3RP/1610N]  3.49,55.88 270 top
R4  [3RP/1610N]  3.49,38.1 270 top
U$1  RIGHTANGLE  [RIGHTANGLE]  4.76,85.09 0 top
U$2  RIGHTANGLE  [RIGHTANGLE]  4.76,21.59 0 top

## Tracks (layer width: path | path; a pad name or v marks a point on that pad's centre or on a via)
+5V
  Top 0.813: IC3.3 C6.1 IC1.3 68.26,31.75 67.23,32.78 67.23,49.77 70.8,53.34 ARD2.12 | JP775.1 JP776.1 JP774.1 JP773.1 JP772.1 JP771.1 JP777.1 JP769.1 JP770.1 JP768.1 JP767.1 JP766.1 JP765.1 JP763.1 JP762.1 JP761.1 JP760.1 JP759.1 JP764.1 JP757.1 JP756.1 JP755.1 JP754.1 JP753.1 JP758.1 JP780.1 JP750.1 JP749.1 JP748.1 JP747.1 JP751.1 JP752.1 JP745.1 JP746.1 JP744.1 JP743.1 JP742.1 JP778.1
  Bottom 0.813: JP778.1 25.08,97.79 26.35,99.06 66.99,99.06 68.26,97.79 68.26,83.82 69.29,82.79 74.46,82.79 75.88,81.37 75.88,54.61 74.61,53.34 ARD2.12
+12V
  Top 0.813: JP152.1 JP151.1 JP150.1 JP149.1 JP148.1 JP147.1 JP146.1 JP145.1 JP144.1 JP143.1 JP142.1 JP141.1 JP140.1 JP139.1 JP138.1 JP137.1 JP136.1 JP135.1 JP134.1 JP133.1 JP132.1 JP131.1 JP130.1 JP129.1 JP128.1 JP127.1 JP126.1 JP125.1 JP124.1 JP123.1 JP122.1 JP121.1 JP120.1 JP119.1 JP118.1 JP117.1 JP115.1 JP114.1 | C7.1 84.77,16.51 POWER.10 | POWER.10 POWER.9 | POWER.10 86.04,19.05 84.77,20.32 C8.+ IC3.1
  Bottom 0.813: POWER.9 93.66,13.97 93.66,5.08 88.99,0.41 23.81,0.41 22.54,1.68 JP152.1
-12V
  Top 0.813: JP267.1 JP268.1 JP269.1 JP277.1 JP270.1 JP271.1 JP272.1 JP273.1 JP274.1 JP275.1 JP276.1 JP278.1 JP279.1 JP280.1 JP281.1 JP282.1 JP283.1 JP284.1 JP285.1 JP286.1 JP287.1 JP288.1 JP289.1 JP290.1 JP291.1 JP292.1 JP293.1 JP294.1 JP295.1 JP296.1 JP297.1 JP298.1 JP299.1 JP300.1 JP301.1 JP302.1 JP304.1 JP303.1 63.59,2.54 65.1,1.03 80.72,1.03 C9.- 84.77,2.54 POWER.2 | POWER.2 POWER.1 | C7.2 84.77,6.35 POWER.2
GND  (94 unrouted)
  pour Top: -0.32,0 -0.32,100.33 96.2,100.33 96.2,0
  pour Bottom: -0.32,0 -0.32,100.33 96.2,100.33 96.2,0
MOSI
  Top 0.457: JP344.1 46.67,99.06 66.99,99.06 68.26,97.79 68.26,83.82 69.53,82.55 70.19,82.55 70.25,82.61 71.35,82.61 71.42,82.55 84.77,82.55 ARD1.2
  Top 0.813: ARD1.2 JP832.1 JP831.1
N$1
  Top 0.813: R2.3 5.95,68.66 JP14.1 JP16.1 JP15.1 JP51.1
N$2
  Top 0.813: R1.3 5.95,86.44 JP2.1 JP3.1 JP5.1 JP45.1
N$3
  Top 0.813: R2.2 JP17.1 JP19.1 JP18.1 JP53.1
N$4
  Top 0.813: R1.2 JP6.1 JP7.1 JP8.1 JP47.1
N$5
  Top 0.813: R1.1 3.57,96.52 JP9.1 JP10.1 JP11.1 JP49.1
N$6
  Top 0.813: R2.1 5.95,78.66 JP20.1 JP22.1 JP21.1 JP55.1
N$7
  Top 0.813: R3.3 5.95,50.88 JP23.1 JP25.1 JP24.1 JP57.1
N$8
  Top 0.813: R3.2 JP26.1 JP28.1 JP27.1 JP59.1
N$9
  Top 0.813: R3.1 3.57,60.96 JP29.1 JP31.1 JP30.1 JP61.1
N$10
  Top 0.813: R4.3 5.95,33.1 JP35.1 JP34.1 JP36.1 JP63.1
N$11
  Top 0.813: R4.2 JP37.1 JP38.1 JP39.1 JP65.1
N$12
  Top 0.813: R4.1 3.57,43.18 JP40.1 JP41.1 JP42.1 JP67.1
N$13
  Top 0.813: GATE1.5 10.6,15.72 12.31,14.01 13.61,14.01 13.65,13.97 14.92,15.24 JP728.1 JP735.1
N$14
  Top 0.813: GATE2.5 7.49,1.31 13.46,1.31 14.69,2.54 JP732.1 JP740.1
N$15
  Top 0.813: JP193.1 JP194.1 JP195.1 JP196.1 JP197.1 JP198.1 JP199.1 JP200.1 JP201.1 JP202.1 JP203.1 JP204.1 JP205.1 JP206.1 JP207.1 JP208.1 JP209.1 JP210.1 JP212.1 JP211.1 JP213.1 JP214.1 JP215.1 JP216.1 JP217.1 JP218.1 JP219.1 JP221.1 JP222.1 JP220.1 JP223.1 JP224.1 JP225.1 JP228.1 JP226.1 JP227.1 JP724.1
N$16
  Top 0.813: JP733.1 JP725.1 16.07,25.52 GATE1.2 9.36,25.4 U$2.P$2
N$17
  Top 0.813: JP232.1 JP233.1 JP234.1 JP230.1 JP239.1 JP240.1 JP241.1 JP242.1 JP235.1 JP236.1 JP237.1 JP238.1 JP247.1 JP248.1 JP249.1 JP250.1 JP243.1 JP244.1 JP245.1 JP246.1 JP255.1 JP256.1 JP257.1 JP258.1 JP251.1 JP252.1 JP253.1 JP254.1 JP263.1 JP264.1 JP265.1 JP259.1 JP260.1 JP261.1 JP262.1 JP723.1
N$18
  Top 0.813: GATE1.3 16.13,22.92 JP726.1 JP734.1
N$19
  Top 0.813: GATE1.4 14.44,17.78 JP727.1 JP736.1
N$20
  Top 0.813: GATE2.2 16.07,12.82 JP729.1 JP737.1
N$21
  Top 0.813: GATE2.3 16.13,10.22 JP730.1 JP738.1
N$22
  Top 0.813: GATE2.4 14.44,5.08 JP731.1 JP739.1
N$23
  Top 0.813: JP91.1 JP92.1
N$25
  Top 0.813: JP46.1 JP48.1
N$26
  Top 0.813: JP50.1 JP52.1
N$27
  Top 0.813: JP54.1 JP56.1
N$28
  Top 0.813: JP60.1 JP58.1
N$29
  Top 0.813: JP62.1 JP64.1
N$30
  Top 0.813: JP66.1 JP68.1
N$31
  Top 0.813: JP69.1 JP70.1
N$32
  Top 0.813: JP72.1 JP71.1
N$33
  Top 0.813: JP73.1 JP74.1
N$34
  Top 0.813: JP75.1 JP76.1
N$35
  Top 0.813: JP78.1 JP77.1
N$36
  Top 0.813: JP79.1 JP80.1
N$37
  Top 0.813: JP82.1 JP81.1
N$38
  Top 0.813: JP83.1 JP84.1
N$39
  Top 0.813: JP86.1 JP85.1
N$40
  Top 0.813: JP116.1 JP87.1 13.65,30.48 11.11,27.94 8.38,27.94 JP789.1
N$41
  Top 0.813: JP89.1 JP88.1
N$42
  Top 0.813: JP90.1 JP93.1
N$43
  Top 0.813: JP95.1 JP94.1
N$44
  Top 0.813: JP96.1 JP97.1
N$45
  Top 0.813: JP99.1 JP98.1
N$46
  Top 0.813: JP101.1 JP100.1
N$48
  Top 0.813: JP105.1 JP104.1
N$49
  Top 0.813: JP107.1 JP106.1
N$50
  Top 0.813: JP108.1 JP109.1
N$51
  Top 0.813: JP110.1 JP111.1
N$52
  Top 0.813: JP113.1 JP112.1
N$53
  Top 0.813: JP102.1 JP103.1 9.72,40.64 JP790.1
N$54
  Top 0.813: ARD2.2 JP797.1 JP798.1
N$55
  Top 0.813: JP799.1 JP800.1 ARD1.11
N$56
  Top 0.813: JP802.1 JP801.1 ARD2.4
N$57
  Top 0.813: ARD2.5 JP803.1 JP804.1
N$58
  Top 0.813: JP806.1 JP805.1 ARD2.6
N$59
  Top 0.813: ARD2.7 JP807.1 JP808.1
N$60
  Top 0.813: JP810.1 JP809.1 ARD2.8
N$61
  Top 0.813: ARD2.9 JP811.1 JP812.1
N$62
  Top 0.813: JP814.1 JP813.1 ARD2.10
N$63
  Top 0.813: ARD2.11 JP815.1 JP816.1
N$64
  Top 0.813: ARD1.10 JP818.1 JP817.1
N$65
  Top 0.813: ARD1.8 JP820.1 JP819.1
N$66
  Top 0.813: ARD1.7 JP822.1 JP821.1
N$67
  Top 0.813: JP823.1 JP824.1 ARD1.6
N$68
  Top 0.813: ARD1.5 JP826.1 JP825.1
N$69
  Top 0.813: JP827.1 JP828.1 ARD1.4
N$70
  Top 0.813: ARD1.3 JP830.1 JP829.1
N$72
  Top 0.813: JP833.1 JP834.1 ARD1.1
N$73
  Top 0.813: JP836.1 JP835.1 ARD1.9
N$74
  Top 0.813: JP838.1 JP837.1 ARD1.14
N$75
  Top 0.813: ARD1.15 JP839.1 JP840.1
N$76
  Top 0.813: ARD1.13 JP841.1 JP842.1
SCK
  Top 0.457: JP796.1 67.06,82.49 67.06,97.07 66.27,97.85 48.01,97.85 JP345.1
  Top 0.813: JP796.1 JP795.1 ARD2.1
VREF
  Top 0.813: ARD2.3 74.61,76.2 75.88,74.93 75.88,45.72 75.43,45.26 75.43,45.17 74.65,44.4 72.02,44.4 71.97,44.45 70.8,44.45 68.26,41.91 68.26,34.29 JP783.1 JP782.1 JP781.1 C13.+ 75.25,27.3 IC1.2

## Text on the board
tPlace: D13 / 3V3 / VREF / A0 / A1 / A2 / A3 / A4 / A5 / A6 / A7 / 5V / RST / GND / VIN | D12 / D11 / D10 / D9 / D8 / D7 / D6 / D5 / D4 / D3 / D2 / GND / RST / D0/RX / D1/TX
bPlace: D13 / 3V3 / VREF / A0 / A1 / A2 / A3 / A4 / A5 / A6 / A7 / 5V / RST / GND / VIN | D12 / D11 / D10 / D9 / D8 / D7 / D6 / D5 / D4 / D3 / D2 / GND / RST / D0/RX / D1/TX
tNames: +12V | +5V | GND | MOSI | SCK | -12V | GND | SCK | MISO | MOSI | SS | RIN | 4.096Vref | TIP | RIN | NOR | NOR | +12V | TIP | RIN | NOR | NOR | TIP | -12V